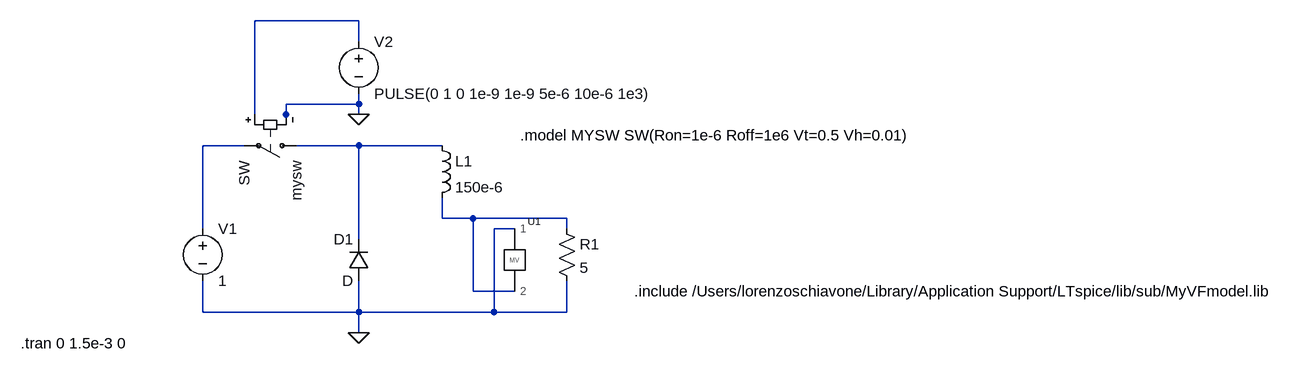
[diagram p0: schematic DCDCbuck_MyComponent.asc]
DCDCbuck_MyComponent.asc, the LTspice schematic file:
Version 4
SHEET 1 1492 680
WIRE 64 32 -96 32
WIRE 64 64 64 32
WIRE 64 160 64 144
WIRE 64 160 -48 160
WIRE -96 176 -96 32
WIRE -48 176 -48 160
WIRE 64 176 64 160
WIRE -48 192 -48 176
WIRE -112 224 -176 224
WIRE 64 224 -32 224
WIRE 192 224 64 224
WIRE 192 336 192 304
WIRE 240 336 192 336
WIRE 384 336 240 336
WIRE -176 352 -176 224
WIRE 304 352 272 352
WIRE 384 352 384 336
WIRE 64 368 64 224
WIRE 240 448 240 336
WIRE 304 448 240 448
WIRE -176 480 -176 432
WIRE 64 480 64 432
WIRE 64 480 -176 480
WIRE 272 480 272 352
WIRE 272 480 64 480
WIRE 384 480 384 432
WIRE 384 480 272 480
WIRE 64 512 64 480
FLAG 64 176 0
FLAG 64 512 0
SYMBOL voltage -176 336 R0
SYMATTR InstName V1
SYMATTR Value 1
SYMBOL diode 80 432 R180
WINDOW 0 24 64 Left 2
WINDOW 3 24 0 Left 2
SYMATTR InstName D1
SYMBOL res 368 336 R0
SYMATTR InstName R1
SYMATTR Value 5
SYMBOL ind 176 208 R0
SYMATTR InstName L1
SYMATTR Value 150e-6
SYMBOL sw -16 224 R90
SYMATTR InstName mysw
SYMATTR SpiceModel mysw
SYMBOL voltage 64 48 R0
SYMATTR InstName V2
SYMATTR Value PULSE(0 1 0 1e-9 1e-9 5e-6 10e-6 1e3)
SYMBOL MyVFmodel 288 384 R0
SYMATTR InstName U1
TEXT 312 208 Left 2 !.model MYSW SW(Ron=1e-6 Roff=1e6 Vt=0.5 Vh=0.01)
TEXT -456 528 Left 2 !.tran 0 1.5e-3 0
TEXT 488 448 Left 2 !.include /Users/lorenzoschiavone/Library/Application Support/LTspice/lib/sub/MyVFmodel.lib

The netlist it stands for:
* DCDCbuck_MyComponent.asc
V1 N002 0 1
D1 0 N003 D
R1 N004 0 5
L1 N003 N004 150e-6
S§mysw N003 N002 N001 0 mysw SW
V2 N001 0 PULSE(0 1 0 1e-9 1e-9 5e-6 10e-6 1e3)
XU1 0 N004 MyVFmodel  ; pins 1 2
.model D D
.lib standard.dio
.model MYSW SW(Ron=1e-6 Roff=1e6 Vt=0.5 Vh=0.01)
.tran 0 1.5e-3 0
.include /Users/lorenzoschiavone/Library/Application Support/LTspice/lib/sub/MyVFmodel.lib
.backanno
.end